# Altium schematic sheet 智能窗帘.schdoc
size A4; Name: A_A4; Symbol: A_A4; Device: A_A4; @Project Name: Sheet_1; REV: 1.0; Date: 2022-04-13; Sheet: 1/1; Draw By: jiaxi; Company: Your Company; Convert to PCB: yes; Add into BOM: yes
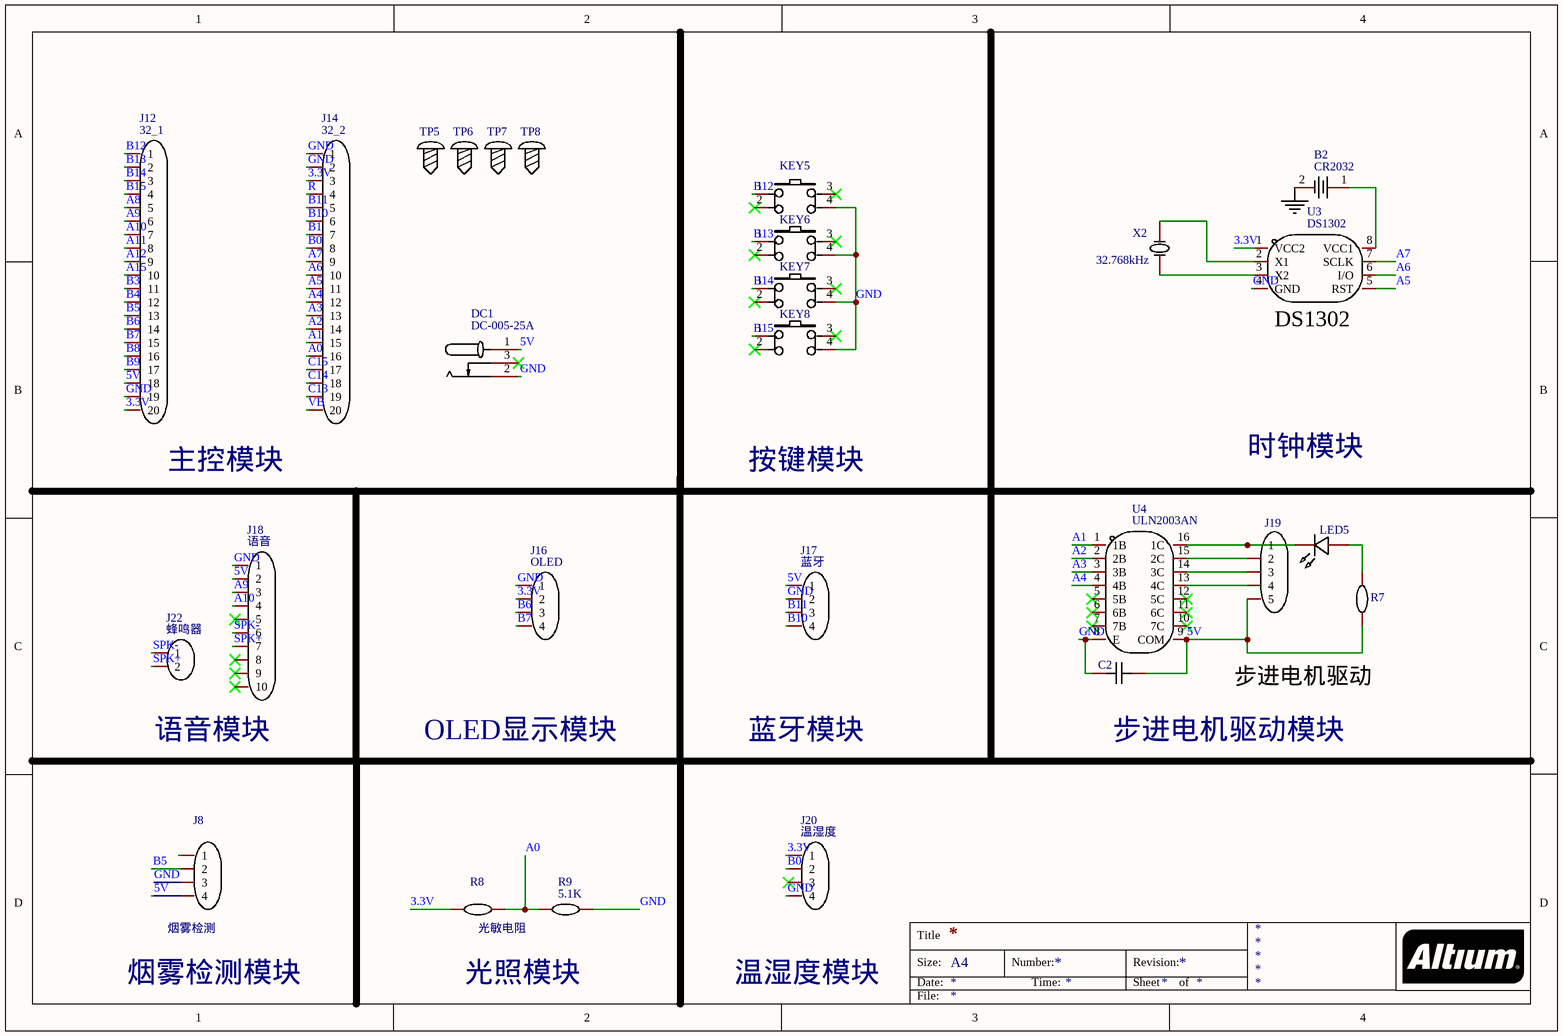
[diagram p0: 智能窗帘.schdoc]

## Parts
B2  CR2032  [BAT-TH_BS-2-1]
C2  100nF  [CAP-TH_L5.5-W2.5-P5.00-D1.0]  (value not drawn)
DC1  DC-005-25A  [DC-IN-TH_DC005]
J8  Name: 烟雾检测  [HDR-M-2.54_1X4]  (hidden comment: 温湿度)
J12  32_1  [HDR-M-2.54_1X20]
J14  32_2  [HDR-M-2.54_1X20]
J16  OLED  [HDR-M-2.54_1X4]
J17  蓝牙  [HDR-M-2.54_1X4]
J18  语音  [HDR-M-2.54_1X10]
J19  HDR-M-2.54_1x5  [HDR-M-2.54_1X5]  (value not drawn)
J20  温湿度  [HDR-M-2.54_1X4]
J22  蜂鸣器  [HDR-M-2.54_1X2]
KEY5  6*6*9  [KEY-TH_4P-L6.0-W6.0-P4.50]  (value not drawn)
KEY6  6*6*9  [KEY-TH_4P-L6.0-W6.0-P4.50]  (value not drawn)
KEY7  6*6*9  [KEY-TH_4P-L6.0-W6.0-P4.50]  (value not drawn)
KEY8  6*6*9  [KEY-TH_4P-L6.0-W6.0-P4.50]  (value not drawn)
LED5  LED-TH-3mm_R  [LED-TH_BD3.0_RED]  (value not drawn)
R7  0.5  [RES-TH_BD1.9-L3.3-P7.30-D0.5]  (value not drawn)
R8  光敏电阻  [RES-TH_BD2.5-L4.7-P8.70-D0.5]
R9  5.1K  [RES-TH_BD2.5-L4.7-P8.70-D0.5]
TP5  M3x6+4  [M3铜柱]  (value not drawn)
TP6  M3x6+4  [M3铜柱]  (value not drawn)
TP7  M3x6+4  [M3铜柱]  (value not drawn)
TP8  M3x6+4  [M3铜柱]  (value not drawn)
U3  DS1302  [DIP-8_L9.7-W6.4-P2.54-LS7.6-BL]
U4  ULN2003AN  [DIP-16_L19.8-W6.5-P2.54-LS7.6-BL]
X2  32.768kHz  [OSC-TH_BD2.0-P0.70-D0.3]

## Nets
GND: B2.2 C2.1 DC1.2 J8.3 J12.19 J14.1 J14.2 J16.1 J17.2 J18.1 J20.4 KEY5.4 KEY6.4 KEY7.4 KEY8.4 R9.2 U3.4(GND) U4.8(E)
3.3V: J12.20 J14.3 J16.2 J20.1 R8.1 U3.1(VCC2)
5V: C2.2 DC1.1 J8.4 J12.18 J17.1 J18.2 J19.5 R7.2 U4.9(COM)
A0: J14.16 R8.2 R9.1
A1: J14.15 U4.1(1B)
A2: J14.14 U4.2(2B)
A3: J14.13 U4.3(3B)
A4: J14.12 U4.4(4B)
A5: J14.11 U3.5(RST)
A6: J14.10 U3.6(I/O)
A7: J14.9 U3.7(SCLK)
A8: J12.5
A9: J12.6 J18.3
A10: J12.7 J18.4
A11: J12.8
A12: J12.9
A15: J12.10
B0: J14.8 J20.2
B1: J14.7
B3: J12.11
B4: J12.12
B5: J8.2 J12.13
B6: J12.14 J16.3
B7: J12.15 J16.4
B8: J12.16
B9: J12.17
B10: J14.6 J17.4
B11: J14.5 J17.3
B12: J12.1 KEY5.1
B13: J12.2 KEY6.1
B14: J12.3 KEY7.1
B15: J12.4 KEY8.1
C13: J14.19
C14: J14.18
C15: J14.17
R: J14.4
SPK+: J18.7 J22.2
SPK-: J18.6 J22.1
VB: J14.20
NetB2_1: B2.1 U3.8(VCC1)
NetJ19_1: J19.1 LED5.2 U4.16(1C)
NetJ19_2: J19.2 U4.15(2C)
NetJ19_3: J19.3 U4.14(3C)
NetJ19_4: J19.4 U4.13(4C)
NetLED5_1: LED5.1 R7.1
NetU3_2: U3.2(X1) X2.2(OSC2)
NetU3_3: U3.3(X2) X2.1(OSC1)

Not connected (* = marked no-connect by the designer): DC1 3*; J8 1; J18 5* 8* 9* 10*; J20 3*; KEY5 2* 3*; KEY6 2* 3*; KEY7 2* 3*; KEY8 2* 3*; U4 5(5B)* 6(6B)* 7(7B)* 10(7C)* 11(6C)* 12(5C)*

## Notes on the sheet
- (near U3) DS1302
- (near J12) 主控模块
- 按键模块
- 时钟模块
- 步进电机驱动
- 语音模块
- OLED显示模块
- 蓝牙模块
- (near C2) 步进电机驱动模块
- 烟雾检测模块
- 光照模块
- 温湿度模块
- Title
- Size:
- Date:
- A4
- Number:
- Time:
- Revision:
- Sheet
- of
- File:

## Library data of the parts
B2 = BS-2-1: Manufacturer: Q&J; Convert to PCB: yes; Name: CR2032; Symbol: CR2032; Device: BS-2-1; Supplier: LCSC; Manufacturer Part: BS-2-1; Supplier Part: C70376; JLCPCB Part Class: Extended Part; Add into BOM: yes; Origin Footprint: BAT-TH_BS-2-1
C2 = CCT104KC6X7RF5FH5A0: Manufacturer: SHM(南方宏明); Convert to PCB: yes; Name: 100nF; Symbol: 100nF; Device: CCT104KC6X7RF5FH5A0; Supplier: LCSC; Supplier Part: C2896145; Manufacturer Part: CCT104KC6X7RF5FH5A0; Add into BOM: yes; Origin Footprint: CAP-TH_L5.5-W2.5-P5.00-D1.0
DC1 = DC-005-25A: Manufacturer: HRO; Convert to PCB: yes; Name: DC-005-25A; Symbol: DC-005-25A; Device: DC-005-25A; Supplier: LCSC; Manufacturer Part: DC-005-25A; Supplier Part: C136715; JLCPCB Part Class: Extended Part; Add into BOM: yes; Origin Footprint: DC-IN-TH_DC005
J8 J20 = 温湿度: Convert to PCB: yes; Symbol: 温湿度; Device: 温湿度; Supplier Part: C124378; Supplier: LCSC; Add into BOM: yes; Origin Footprint: HDR-M-2.54_1X4
  J20: Name: 温湿度
J12 = 32_1: Convert to PCB: yes; Name: 32_1; Symbol: 32_1; Device: 32_1; Supplier Part: C50981; Supplier: LCSC; Add into BOM: yes; Origin Footprint: HDR-M-2.54_1X20
J14 = 32_2: Convert to PCB: yes; Name: 32_2; Symbol: 32_2; Device: 32_2; Supplier Part: C50981; Supplier: LCSC; Add into BOM: yes; Origin Footprint: HDR-M-2.54_1X20
J16 = OLED: Convert to PCB: yes; Name: OLED; Symbol: OLED; Device: OLED; Supplier Part: C124378; Supplier: LCSC; Add into BOM: yes; Origin Footprint: HDR-M-2.54_1X4
J17 = 蓝牙: Convert to PCB: yes; Name: 蓝牙; Symbol: 蓝牙; Device: 蓝牙; Supplier Part: C124378; Supplier: LCSC; Add into BOM: yes; Origin Footprint: HDR-M-2.54_1X4
J18 = 语音: Convert to PCB: yes; Name: 语音; Symbol: 语音; Device: 语音; Supplier Part: C57369; Supplier: LCSC; Add into BOM: yes; Origin Footprint: HDR-M-2.54_1X10
J19 = HDR-M-2.54_1x5: Convert to PCB: yes; Name: HDR-M-2.54_1x5; Symbol: HDR-M-2.54_1x5; Device: HDR-M-2.54_1x5; Supplier Part: C358687; Supplier: LCSC; Add into BOM: yes; Origin Footprint: HDR-M-2.54_1X5
J22 = 蜂鸣器: Convert to PCB: yes; Name: 蜂鸣器; Symbol: 蜂鸣器; Device: 蜂鸣器; Supplier Part: C124375; Supplier: LCSC; Add into BOM: yes; Origin Footprint: HDR-M-2.54_1X2
KEY5-KEY8 = 6*6*9: Manufacturer: ReliaPro; Convert to PCB: yes; Name: 6*6*9; Symbol: 6*6*9; Device: 6*6*9; Supplier Part: C70910; Supplier: LCSC; Manufacturer Part: 6*6*9; Add into BOM: yes; Origin Footprint: KEY-TH_4P-L6.0-W6.0-P4.50
LED5 = 204-10SDRD/S530-A3-L: Manufacturer: EVERLIGHT(台湾亿光); Convert to PCB: yes; Name: LED-TH-3mm_R; Symbol: LED-TH-3mm_R; Device: 204-10SDRD/S530-A3-L; Manufacturer Part: 204-10SDRD/S530-A3-L; Supplier Part: C84774; Supplier: LCSC; Add into BOM: yes; Origin Footprint: LED-TH_BD3.0_RED
R7 = CF1/6W-0.5Ω±5% T52: Manufacturer: CCO; Resistance: 0.5Ω; Convert to PCB: yes; Name: 0.5; Symbol: 0.5; Device: CF1/6W-0.5Ω±5% T52; Supplier: LCSC; Manufacturer Part: CF1/6W-0.5Ω±5% T52; Supplier Part: C119790; JLCPCB Part Class: Extended Part; Add into BOM: yes; Origin Footprint: RES-TH_BD1.9-L3.3-P7.30-D0.5
R8 = RN16T51001F: Manufacturer: TA-I Tech; Symbol: 5.1K; Resistance: 1kΩ; Convert to PCB: yes; Name: 光敏电阻; Device: RN16T51001F; Supplier: LCSC; Supplier Part: C172669; Manufacturer Part: RN16T51001F; JLCPCB Part Class: Extended Part; Add into BOM: yes; Origin Footprint: RES-TH_BD2.5-L4.7-P8.70-D0.5
R9 = RN16T51001F: Manufacturer: TA-I Tech; Resistance: 1kΩ; Convert to PCB: yes; Name: 5.1K; Symbol: 5.1K; Device: RN16T51001F; Supplier: LCSC; Supplier Part: C172669; Manufacturer Part: RN16T51001F; JLCPCB Part Class: Extended Part; Add into BOM: yes; Origin Footprint: RES-TH_BD2.5-L4.7-P8.70-D0.5
TP5-TP8 = M3x6+4: Convert to PCB: yes; Name: M3x6+4; Symbol: M3x6+4; Device: M3x6+4; Supplier Part: C551320; Add into BOM: yes; Origin Footprint: M3铜柱
U3 = DS1302N: Manufacturer: HGSEMI; Convert to PCB: yes; Name: DS1302; Symbol: DS1302; Device: DS1302N; Supplier: LCSC; Supplier Part: C398065; Manufacturer Part: DS1302N; JLCPCB Part Class: Extended Part; Add into BOM: yes; Origin Footprint: DIP-8_L9.7-W6.4-P2.54-LS7.6-BL
U4 = ULN2003AN: Manufacturer: HTC Korea TAEJIN Tech; Convert to PCB: yes; Name: ULN2003AN; Symbol: ULN2003AN; Device: ULN2003AN; Supplier: LCSC; Supplier Part: C510564; Manufacturer Part: ULN2003AN; JLCPCB Part Class: Extended Part; Add into BOM: yes; Origin Footprint: DIP-16_L19.8-W6.5-P2.54-LS7.6-BL
X2 = 26S-32.768-12.5-10-10/B: Manufacturer: LIMING(利明); Convert to PCB: yes; Name: 32.768kHz; Symbol: 32.768kHz; Device: 26S-32.768-12.5-10-10/B; Supplier: LCSC; Supplier Part: C518064; Manufacturer Part: 26S-32.768-12.5-10-10/B; Add into BOM: yes; Origin Footprint: OSC-TH_BD2.0-P0.70-D0.3